# Altium schematic sheet carte_electronique_didactique_PittetL02_SCH.SchDoc
size A3; SheetNumber: 1; SheetTotal: 1; SheetName: /
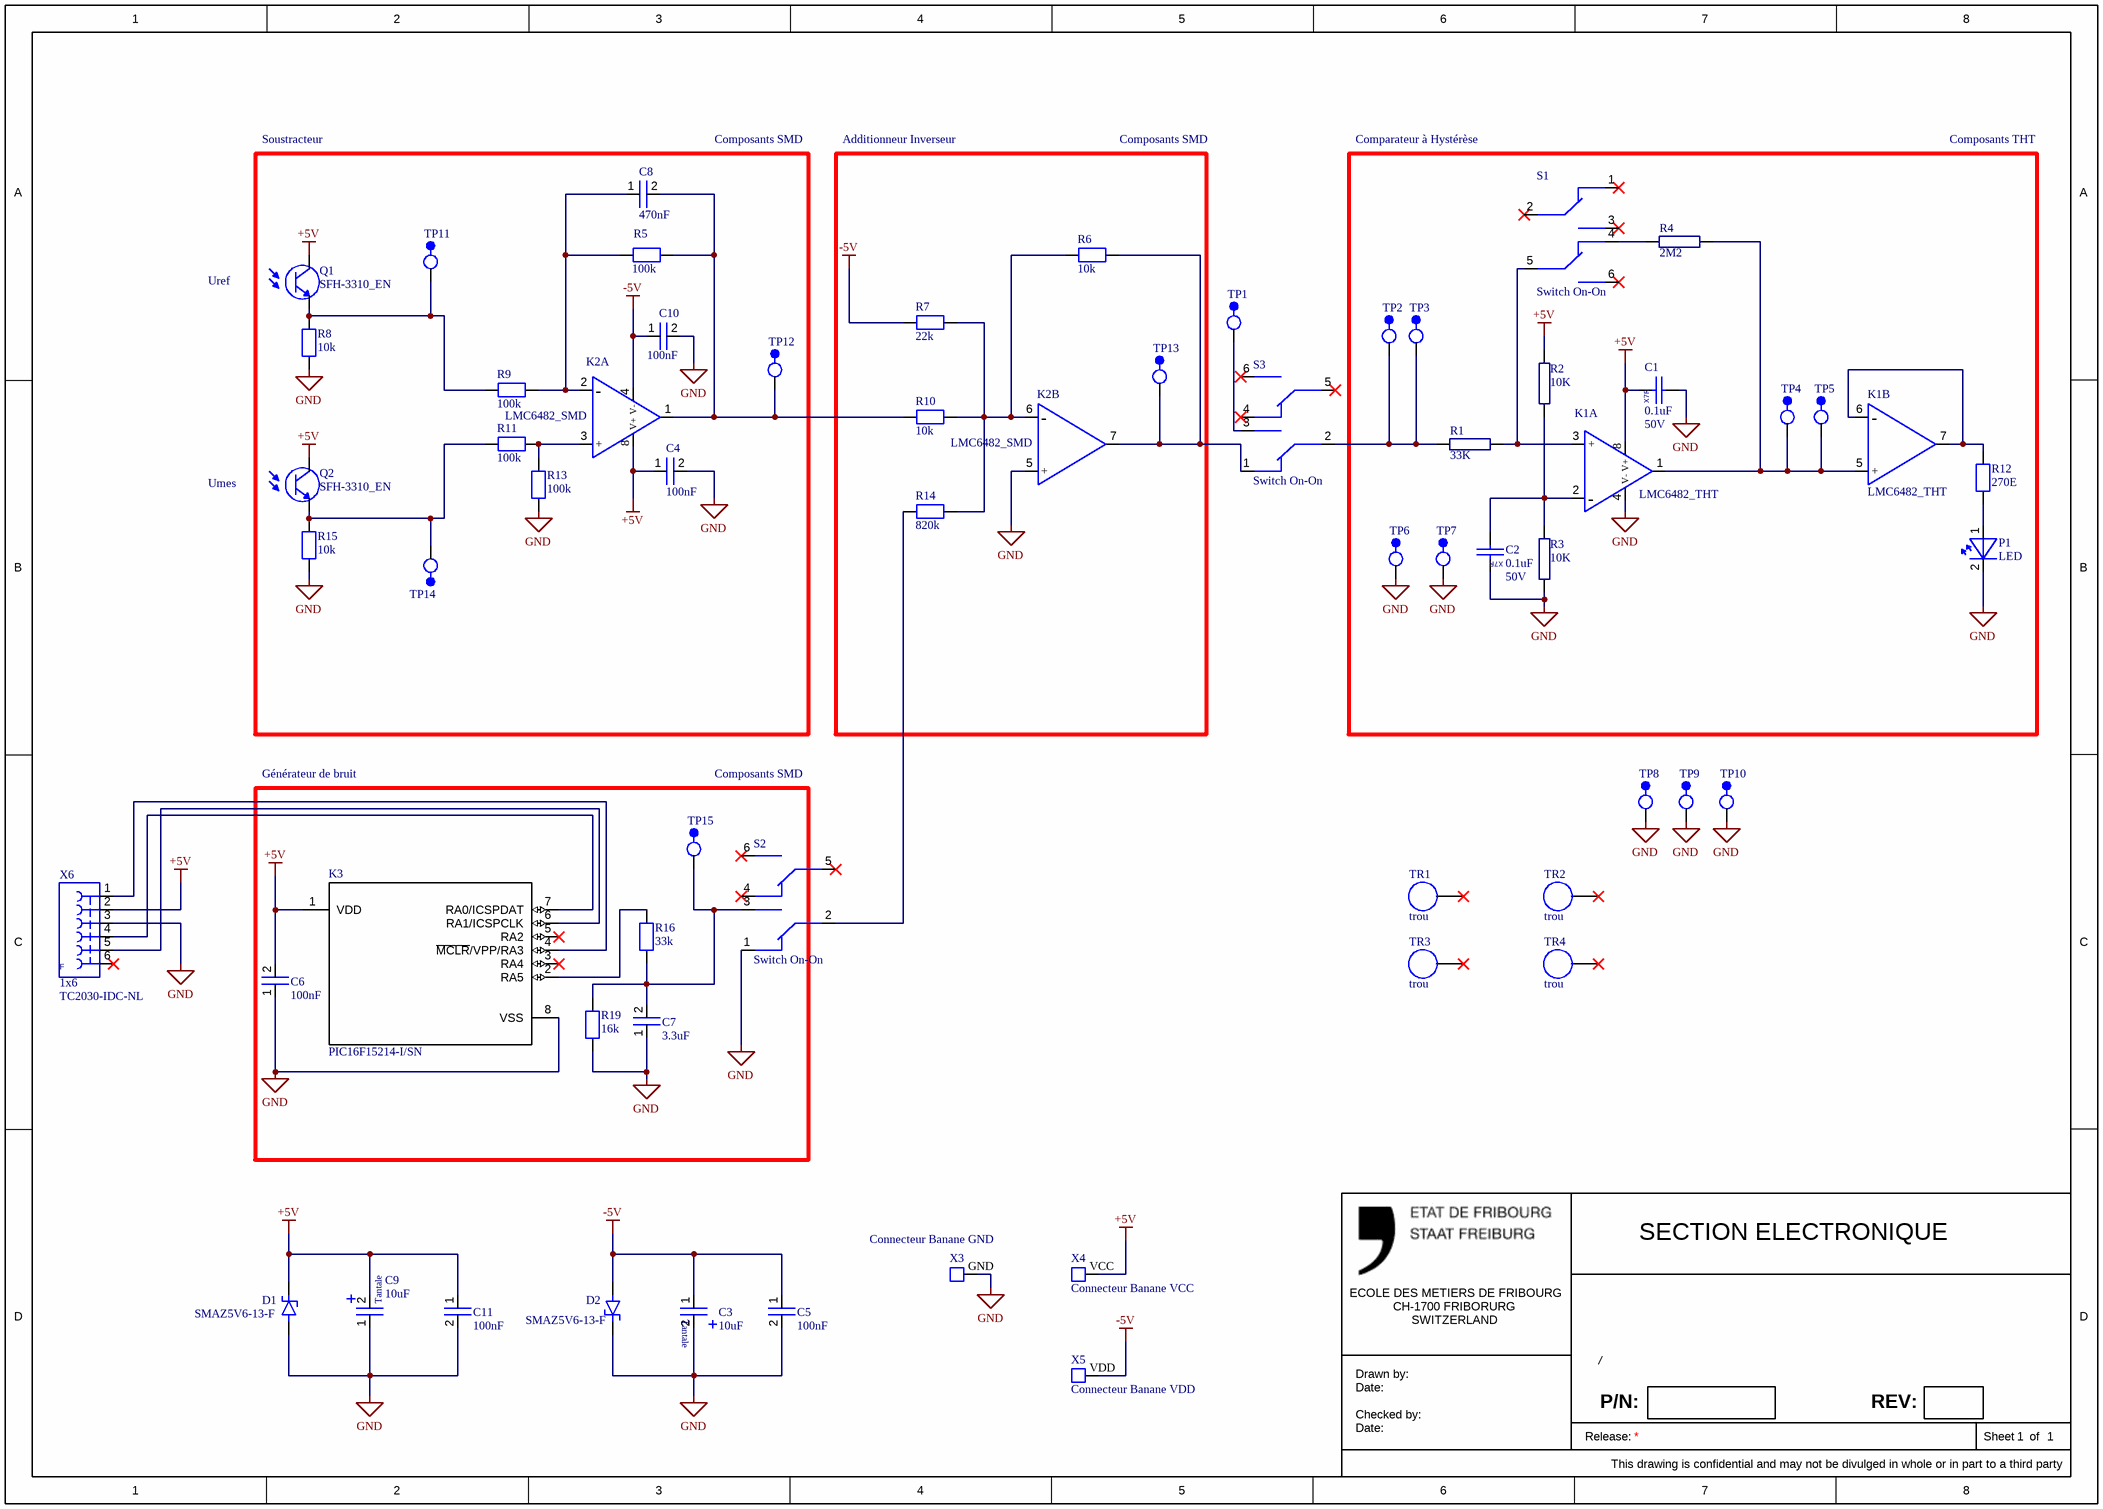
[diagram p0: carte_electronique_didactique_PittetL02_SCH.SchDoc]

## Parts
C1  0.1uF  Volt: 50V  [CTHTNP8x4x11e5]
C2  0.1uF  Volt: 50V  [CTHTNP8x4x11e5]
C3  10uF  [C_0805 tantale]
C4  100nF  [C_0805 ceramique]
C5  100nF  [C_0805 ceramique]
C6  100nF  [C_0805 ceramique]
C7  3.3uF  [C_0805 ceramique]
C8  470nF  [C_0805 ceramique]
C9  10uF  [C_0805 tantale]
C10  100nF  [C_0805 ceramique]
C11  100nF  [C_0805 ceramique]
D1  SMAZ5V6-13-F  [DIOM5226X240N]
D2  SMAZ5V6-13-F  [DIOM5226X240N]
K1  LMC6482_THT  [LMC6482_THT]  (parts A,B of 2)
K2  LMC6482_SMD  [LMC6482_SMD]  (parts A,B of 2)
K3  PIC16F15214-I/SN  [PIC16F15214-I/SN]
P1  LED  [LED]
Q1  SFH-3310_EN  [SFH-3310_EN]
Q2  SFH-3310_EN  [SFH-3310_EN]
R1  33K  [RTHT0250W]
R2  10K  [RTHT0250W]
R3  10K  [RTHT0250W]
R4  2M2  [RTHT0250W]
R5  100k  [Resistances 1206]
R6  10k  [Resistances 1206]
R7  22k  [Resistances 1206]
R8  10k  [Resistances 1206]
R9  100k  [Resistances 1206]
R10  10k  [Resistances 1206]
R11  100k  [Resistances 1206]
R12  270E  [Resistances 1206]
R13  100k  [Resistances 1206]
R14  820k  [Resistances 1206]
R15  10k  [Resistances 1206]
R16  33k  [Resistances 1206]
R19  16k  [Resistances 1206]
S1  Switch On-On  [Slide Switches]
S2  Switch On-On  [Slide Switches]
S3  Switch On-On  [Slide Switches]
TP1  TP rouge  [TP10_22]  (value not drawn)
TP2  TP rouge  [TP10_22]  (value not drawn)
TP3  TP rouge  [TP10_22]  (value not drawn)
TP4  TP bleu  [TP10_22]  (value not drawn)
TP5  TP bleu  [TP10_22]  (value not drawn)
TP6  TP noir  [TP10_22]  (value not drawn)
TP7  TP noir  [TP10_22]  (value not drawn)
TP8  TP noir  [TP10_22]  (value not drawn)
TP9  TP noir  [TP10_22]  (value not drawn)
TP10  TP noir  [TP10_22]  (value not drawn)
TP11  TP rouge  [TP10_22]  (value not drawn)
TP12  TP rouge  [TP10_22]  (value not drawn)
TP13  TP rouge  [TP10_22]  (value not drawn)
TP14  TP rouge  [TP10_22]  (value not drawn)
TP15  TP rouge  [TP10_22]  (value not drawn)
TR1  trou  [trou]
TR2  trou  [trou]
TR3  trou  [trou]
TR4  trou  [trou]
X3  Connecteur Banane GND  [CT3151-0]
X4  Connecteur Banane VCC  [CT3151-2]
X5  Connecteur Banane VDD  [CT3151-4]
X6  1x6  Manufacturer Part Number 1: TC2030-IDC-NL  [CONN_TC2030NL]

## Nets
+5V: C1.1 C4.1 C6.2 C9.2 C11.1 D1.1(K) K1.8(V+) K2.8(V+) K3.1(VDD) Q1.2(C) Q2.2(C) R2.1 X4.VCC X6.2
-5V: C3.1 C5.1 C10.1 D2.2(A) K2.4(V-) R7.1 X5.VDD
GND: C1.2 C2.1 C3.2 C4.2 C5.2 C6.1 C7.1 C9.1 C10.2 C11.2 D1.2(A) D2.1(K) K1.4(V-) K2.5(+) K3.8(VSS) P1.2 R3.2 R8.1 R13.1 R15.1 R19.1 S2.1 TP6.1(a) TP7.1(a) TP8.1(a) TP9.1(a) TP10.1(a) X3.GND X6.3
NetC2_2: C2.2 K1.2(-) R2.2 R3.1
NetC7_2: C7.2 R16.1 R19.2 S2.3 TP15.1(a)
NetC8_1: C8.1 K2.2(-) R5.1 R9.2
NetC8_2: C8.2 K2.1 R5.2 R10.1 TP12.1(a)
NetK1_1: K1.1 K1.5(+) R4.2 TP4.1(a) TP5.1(a)
NetK1_3: K1.3(+) R1.2 S1.5
NetK1_6: K1.6(-) K1.7 R12.1
NetK2_3: K2.3(+) R11.2 R13.2
NetK2_6: K2.6(-) R6.1 R7.2 R10.2 R14.2
NetK2_7: K2.7 R6.2 S3.1 TP13.1(a)
NetK3_2: K3.2(RA5) R16.2
NetK3_4: K3.4(~{MCLR}/VPP/RA3) X6.1
NetK3_6: K3.6(RA1/ICSPCLK) X6.5
NetK3_7: K3.7(RA0/ICSPDAT) X6.4
NetP1_1: P1.1 R12.2
NetQ1_1: Q1.1(E) R8.2 R9.1 TP11.1(a)
NetQ2_1: Q2.1(E) R11.1 R15.2 TP14.1(a)
NetR1_1: R1.1 S3.2 TP2.1(a) TP3.1(a)
NetR4_1: R4.1 S1.4
NetR14_1: R14.1 S2.2
NetS3_3: S3.3 TP1.1(a)

Not connected (* = marked no-connect by the designer): K3 3(RA4)* 5(RA2)*; S1 1* 2* 3* 6*; S2 4* 5* 6*; S3 4* 5* 6*; TR1 1(78)*; TR2 1(78)*; TR3 1(78)*; TR4 1(78)*; X6 6*

## Notes on the sheet
- Soustracteur
- Composants SMD
- Additionneur Inverseur
- Comparateur à Hystérèse
- Composants THT
- Uref
- Umes
- Générateur de bruit
- SECTION ELECTRONIQUE
- CH-1700 FRIBORURG
- SWITZERLAND
- ECOLE DES METIERS DE FRIBOURG
- Drawn by:
- Date:
- Checked by:
- Release:
- P/N:
- REV:
- Sheet
- of
- This drawing is confidential and may not be divulged in whole or in part to a third party
- (in symbol CCER_THT-11) X7R
- (in symbol CONDO 1uF Tantale) Tantale
- (in symbol CONN_TC2030) F

## Library data of the parts
C1 C2 = CCER_THT-11: C CER X7R 0,1uF/50V 20% DEC (E=5); Manufacturer Part Number 1: K104M15X7RF5UH5; Type: CX7R; EMF_PN: CCER_THT-11; Value: 0.1uF
C3 C9 = CONDO 1uF Tantale: 0805
C4-C8 C10 C11 = CONDO 100nf: 0805
D1 D2 = SMAZ5V6-13-F: Diode zener; MF: {'manufacturer': u'Diodes Incorporated'}; Package: None; Price: None; Value: *; MP: SMAZ5V6-13-F; Availability: Unavailable
Q1 Q2 = SFH-3310_EN: Photo-transistor
R1 = RMETAL0250W-32: R METAL 33K  1%  1/2W; Tol: 0.01; Power: 0.5W; Stab(ppm): 100; EMF_PN: RMETAL0250W-32; Value: 33K; Type: RSTD025
R2 R3 = RMETAL0250W-26: R METAL 10K  1%  1/2W; Tol: 0.01; Power: 0.5W; Stab(ppm): 100; EMF_PN: RMETAL0250W-26; Value: 10K; Type: RSTD025
R4 = RMETAL0250W-52: R METAL 2M2  1% 1/2W; Tol: 0.01; Power: 0.5W; Stab(ppm): 100; EMF_PN: RMETAL0250W-52; Value: 2M2; Type: RSTD025
R5-R16 R19 = Resistances smd 1206: Resistance 1206; Part Number: ERA6AEB472V; Manufacturer: Panasonic; Manufacturer Part Number 1: ERA-6AEB472V; Manufacturer 1: Panasonic
S1-S3 = Switch On-On: Switch on-on de côté
TP1-TP3 TP11-TP15 = TP-04: Point de test CI isolé rouge; Manufacturer Part Number 1: 5000; Manufacturer 1: Keystone Electronics; EMF_PN: TP-04; Value: TP rouge; Type: TP
TP4 TP5 = TP-02: Point de test CI isolé bleu; Manufacturer Part Number 1: 5117; Manufacturer 1: Keystone Electronics; EMF_PN: TP-02; Value: TP bleu; Type: TP
TP6-TP10 = TP-03: Point de test CI isolé noir; Manufacturer Part Number 1: 5001; Manufacturer 1: Keystone Electronics; EMF_PN: TP-03; Value: TP noir; Type: TP
X6 = CONN_TC2030: Conn. avec plage pour contact à ressort TAG-Connect TC2030-IDC-NL; Nb pins: 6; Pas (mm): 1.27; EMF_PN: CONN_TC2030; Value: 1x6; Famille: TAG-CONNECT; Type: Smd\TAG; Manufacturer 1: TAG-CONNECT